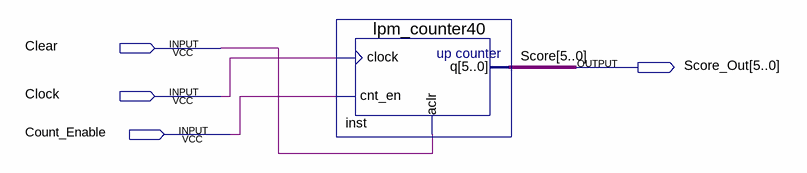
[diagram p0: schematic sheet]
// Quartus schematic Score.bdf as structural Verilog: 1 symbols, 4 pins
module Score (
  input  Clear,
  input  Clock,
  input  Count_Enable,
  output [5:0] Score_Out
);

  lpm_counter40 inst (.clock(Clock), .cnt_en(Count_Enable), .aclr(Clear), .q(Score_Out));

  // Other names for the same wires on the sheet: Score[5:0] = Score_Out
endmodule
